# Altium schematic sheet ModTeensy.SchDoc
size A4; SheetNumber: 2; SheetTotal: 6
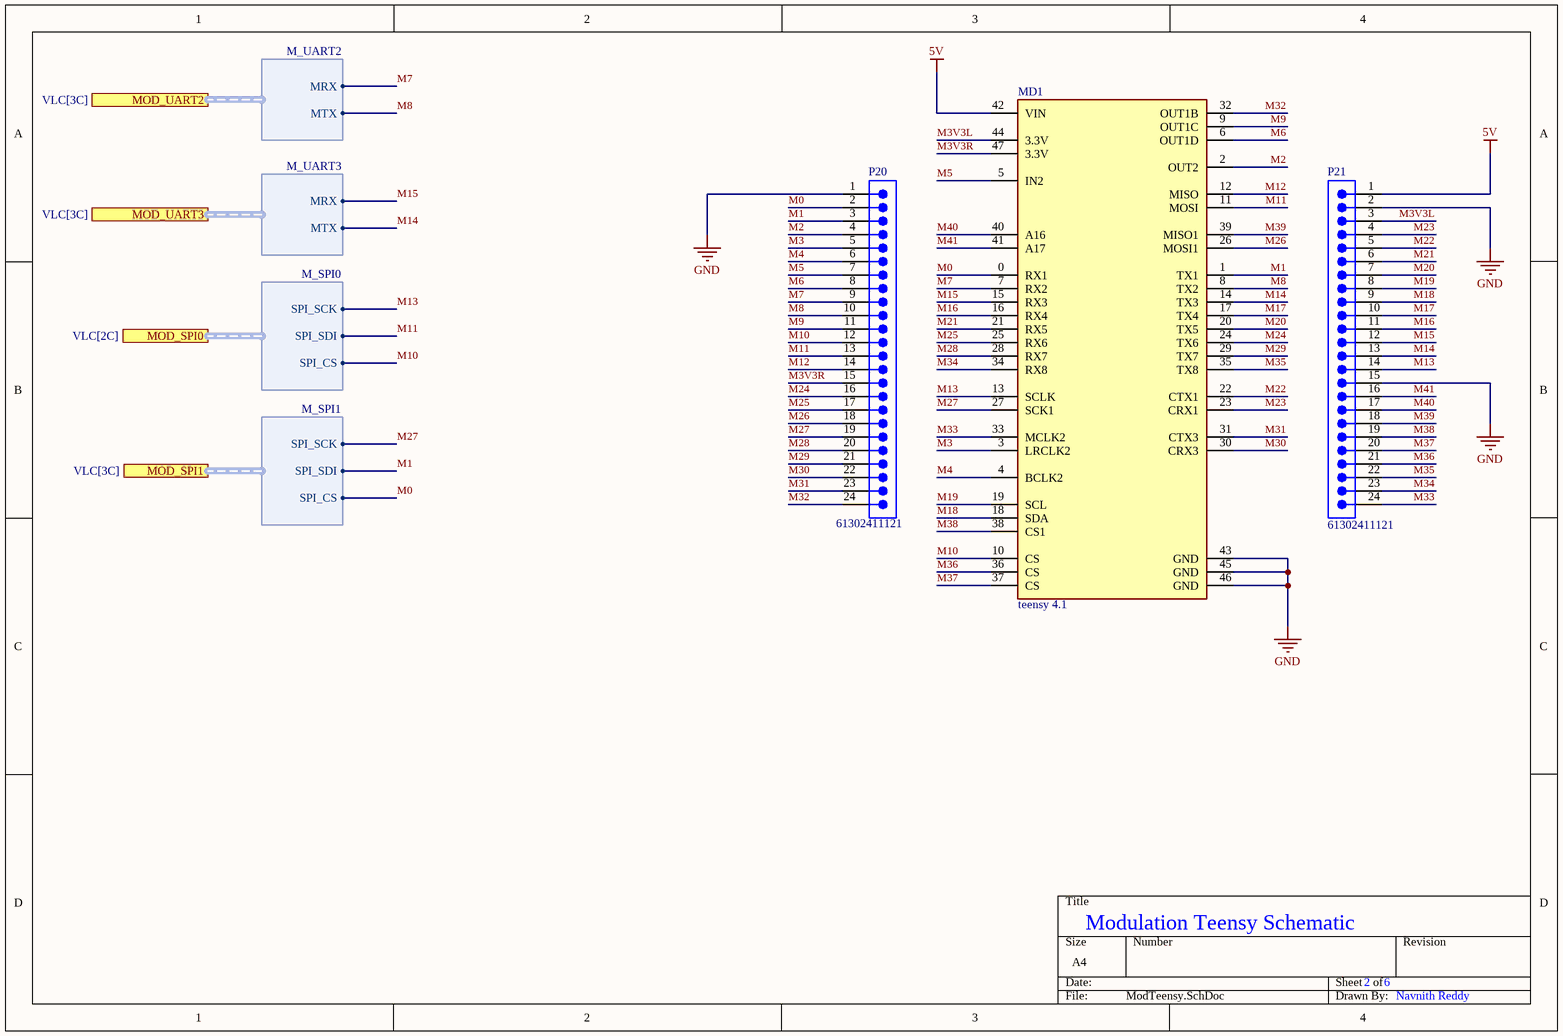
[diagram p0: ModTeensy.SchDoc]

## Parts
MD1  teensy 4.1  [FP-DEV-16996-MFG]
P20  61302411121  [61302411121]
P21  61302411121  [61302411121]

## Ports
MOD_SPI0 (harness M_SPI0, see VLC[2C]), MOD_SPI1 (harness M_SPI1, see VLC[3C]), MOD_UART2 (harness M_UART2, see VLC[3C]), MOD_UART3 (harness M_UART3, see VLC[3C])

## Harnesses
M_SPI0: SPI_SCK, SPI_SDI, SPI_CS
M_UART3: MRX, MTX
M_UART2: MRX, MTX
M_SPI1: SPI_SCK, SPI_SDI, SPI_CS

## Nets
5V: MD1.42(VIN) P21.1
GND: MD1.43(GND) MD1.45(GND) MD1.46(GND) P20.1 P21.2 P21.15
M0: MD1.0(RX1) P20.2 ; port MOD_SPI1.SPI_CS
M1: MD1.1(TX1) P20.3 ; port MOD_SPI1.SPI_SDI
M2: MD1.2(OUT2) P20.4
M3: MD1.3(LRCLK2) P20.5
M3V3L: MD1.44(3.3V) P21.3
M3V3R: MD1.47(3.3V) P20.15
M4: MD1.4(BCLK2) P20.6
M5: MD1.5(IN2) P20.7
M6: MD1.6(OUT1D) P20.8
M7: MD1.7(RX2) P20.9 ; port MOD_UART2.MRX
M8: MD1.8(TX2) P20.10 ; port MOD_UART2.MTX
M9: MD1.9(OUT1C) P20.11
M10: MD1.10(CS) P20.12 ; port MOD_SPI0.SPI_CS
M11: MD1.11(MOSI) P20.13 ; port MOD_SPI0.SPI_SDI
M12: MD1.12(MISO) P20.14
M13: MD1.13(SCLK) P21.14 ; port MOD_SPI0.SPI_SCK
M14: MD1.14(TX3) P21.13 ; port MOD_UART3.MTX
M15: MD1.15(RX3) P21.12 ; port MOD_UART3.MRX
M16: MD1.16(RX4) P21.11
M17: MD1.17(TX4) P21.10
M18: MD1.18(SDA) P21.9
M19: MD1.19(SCL) P21.8
M20: MD1.20(TX5) P21.7
M21: MD1.21(RX5) P21.6
M22: MD1.22(CTX1) P21.5
M23: MD1.23(CRX1) P21.4
M24: MD1.24(TX6) P20.16
M25: MD1.25(RX6) P20.17
M26: MD1.26(MOSI1) P20.18
M27: MD1.27(SCK1) P20.19 ; port MOD_SPI1.SPI_SCK
M28: MD1.28(RX7) P20.20
M29: MD1.29(TX7) P20.21
M30: MD1.30(CRX3) P20.22
M31: MD1.31(CTX3) P20.23
M32: MD1.32(OUT1B) P20.24
M33: MD1.33(MCLK2) P21.24
M34: MD1.34(RX8) P21.23
M35: MD1.35(TX8) P21.22
M36: MD1.36(CS) P21.21
M37: MD1.37(CS) P21.20
M38: MD1.38(CS1) P21.19
M39: MD1.39(MISO1) P21.18
M40: MD1.40(A16) P21.17
M41: MD1.41(A17) P21.16

## Notes on the sheet
- Modulation Teensy Schematic
- 2
- 6
- Navnith Reddy

## Library data of the parts
MD1 = CMP-157412-000001-1: TEENSY 4.1 (HEADERS)
P20 P21 = CMP-1502-01109-2: NexarPartId: 32855561; Number of Contacts: 24; Connector Type: Male Pin; Operating Supply Voltage: 250V; Pitch: 2.54mm; Gender: Male; Current Rating: 3A; Contact Resistance: 20mΩ; Mount: Through Hole; Contact Plating: Gold; Lead Pitch: 2.54mm; Orientation: Vertical; Color: Black; Packaging: Bulk; REACH SVHC: Unknown; Termination: Solder; Number of Positions: 24; RoHS: Compliant; Contact Mating Length: 5.9944mm; Number of Pins: 24; Contact Material: Copper; Number of Rows: 1